# EAGLE design TrafficLights (EAGLE 9.4.2)

## Sheet 1 of 3
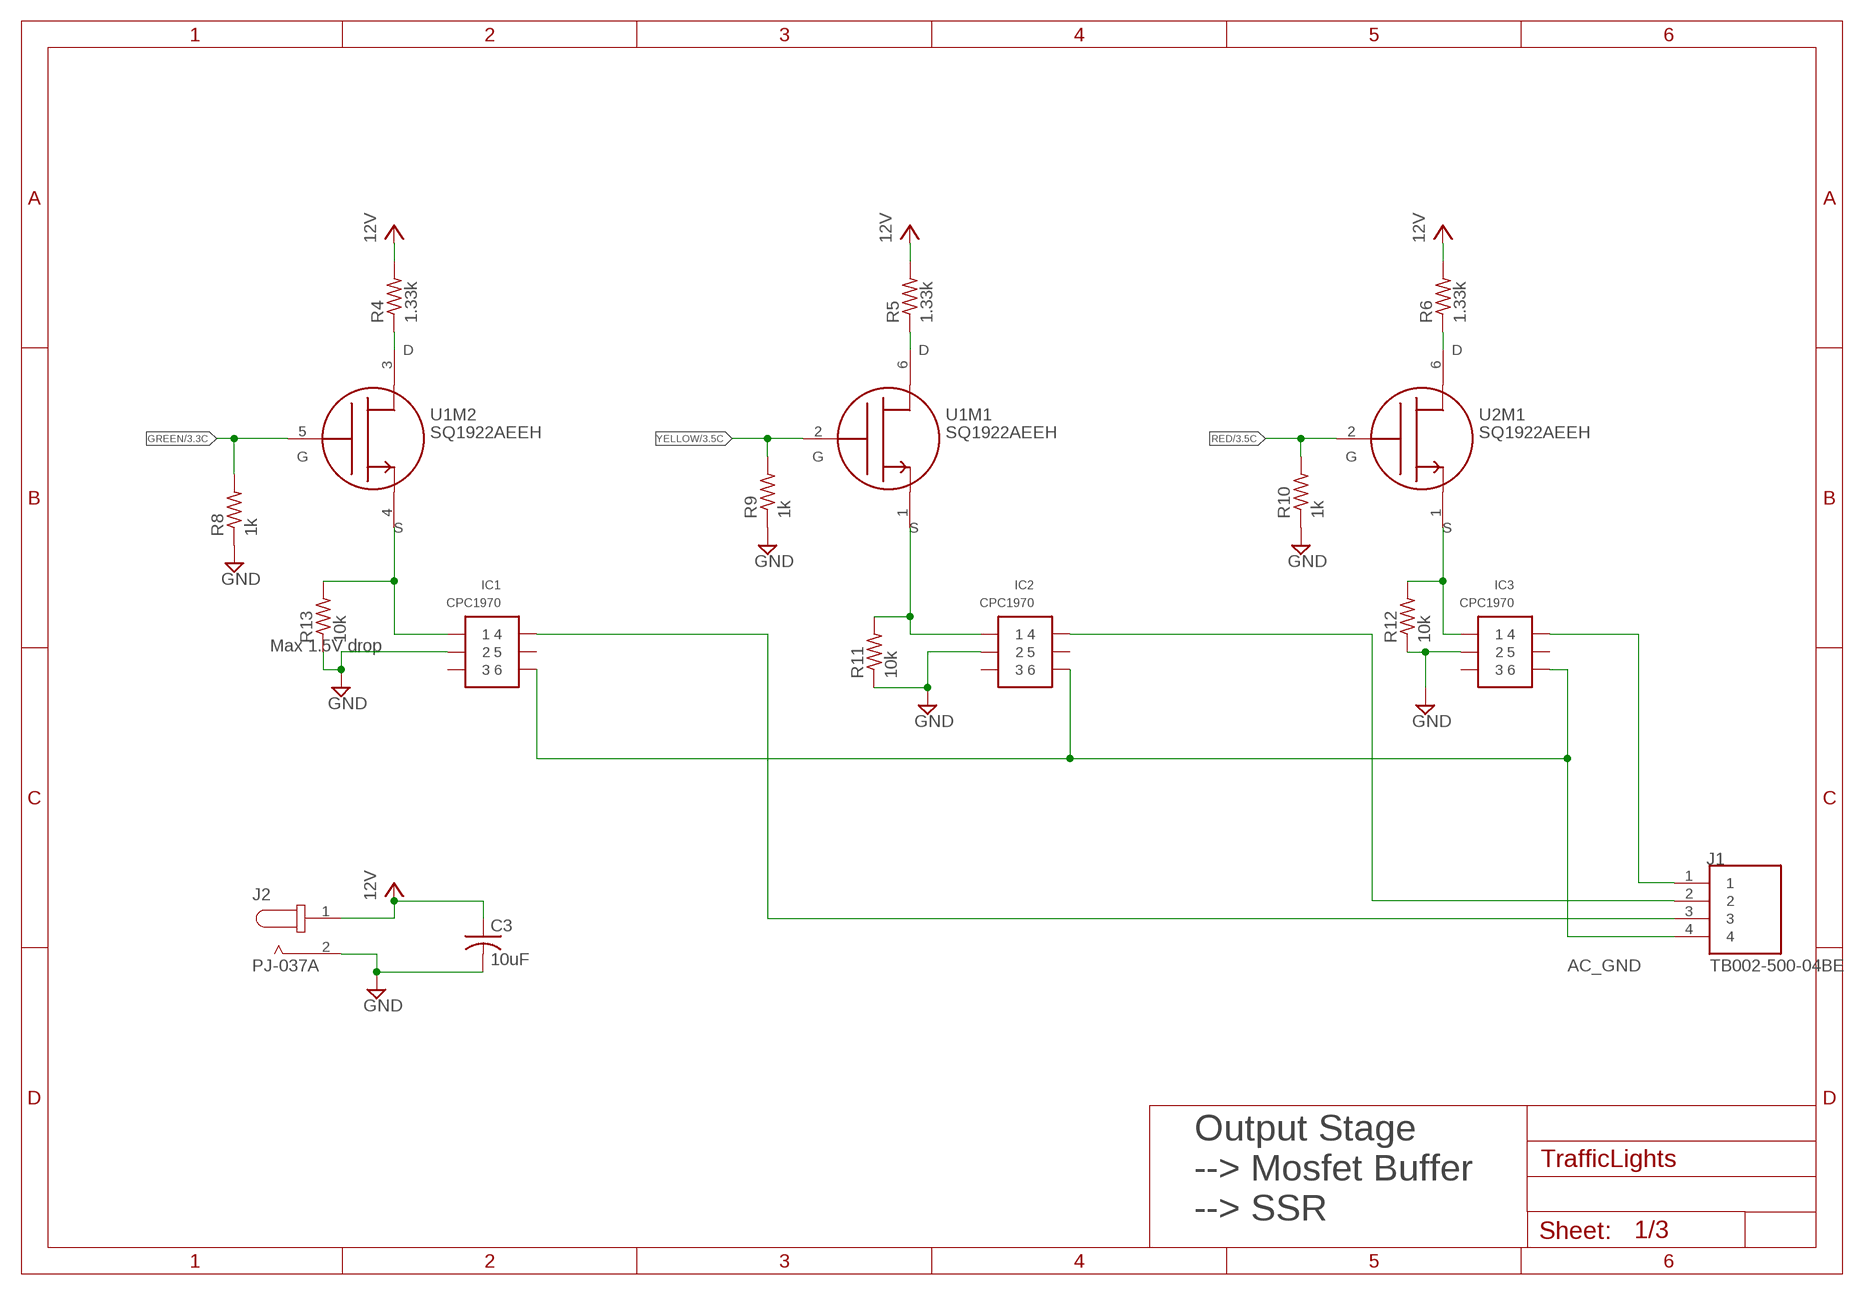
[diagram p0: schematic, sheet 1]

### Parts
C3  10uF  C-USC1206  [C1206]
IC1  CPC1970  CPC1972  [6-DIP]
IC2  CPC1970  CPC1972  [6-DIP]
IC3  CPC1970  CPC1972  [6-DIP]
J1  TB002-500-04BE  [CUI_TB002-500-04BE]
J2  PJ-037A  [CUI_PJ-037A]
R4  1.33k  R-US_R1206  [R1206]
R5  1.33k  R-US_R1206  [R1206]
R6  1.33k  R-US_R1206  [R1206]
R8  1k  R-US_R1206  [R1206]
R9  1k  R-US_R1206  [R1206]
R10  1k  R-US_R1206  [R1206]
R11  10k  R-US_0207/2V  [0207/2V]
R12  10k  R-US_0207/2V  [0207/2V]
R13  10k  R-US_R1206  [R1206]
U1  SQ1922AEEH  [SOT-363]
U2  SQ1922AEEH  [SOT-363]

### Nets
AC_GND: IC1.P$6 IC2.P$6 IC3.P$6 J1.4
GND: C3.2 IC1.P$2 IC2.P$2 IC3.P$2 J2.2 R8.1 R9.1 R10.1 R11.1 R12.1 R13.1 ; also sheet 2,3
GREEN: R8.2 U1.5(M2:G) ; also sheet 3
N$1: IC1.P$1 R13.2 U1.4(M2:S)
N$2: IC2.P$1 R11.2 U1.1(M1:S)
N$3: IC3.P$1 R12.2 U2.1(M1:S)
N$17: R4.1 U1.3(M2:D)
N$18: R5.1 U1.6(M1:D)
N$19: R6.1 U2.6(M1:D)
N$21: IC2.P$4 J1.2
N$22: IC3.P$4 J1.1
RED: R10.2 U2.2(M1:G) ; also sheet 3
VAC: IC1.P$4 J1.3
VCC: C3.1 J2.1 R4.2 R5.2 R6.2 ; supply symbol labelled 12V ; also sheet 2,3
YELLOW: R9.2 U1.2(M1:G) ; also sheet 3
Unconnected: IC1.P$3 IC1.P$5 IC2.P$3 IC2.P$5 IC3.P$3 IC3.P$5 U2.3(M2:D) U2.4(M2:S) U2.5(M2:G)

### Notes on the sheet
- Max 1.5V drop
- Output Stage
  --> Mosfet Buffer
  --> SSR

## Sheet 2 of 3
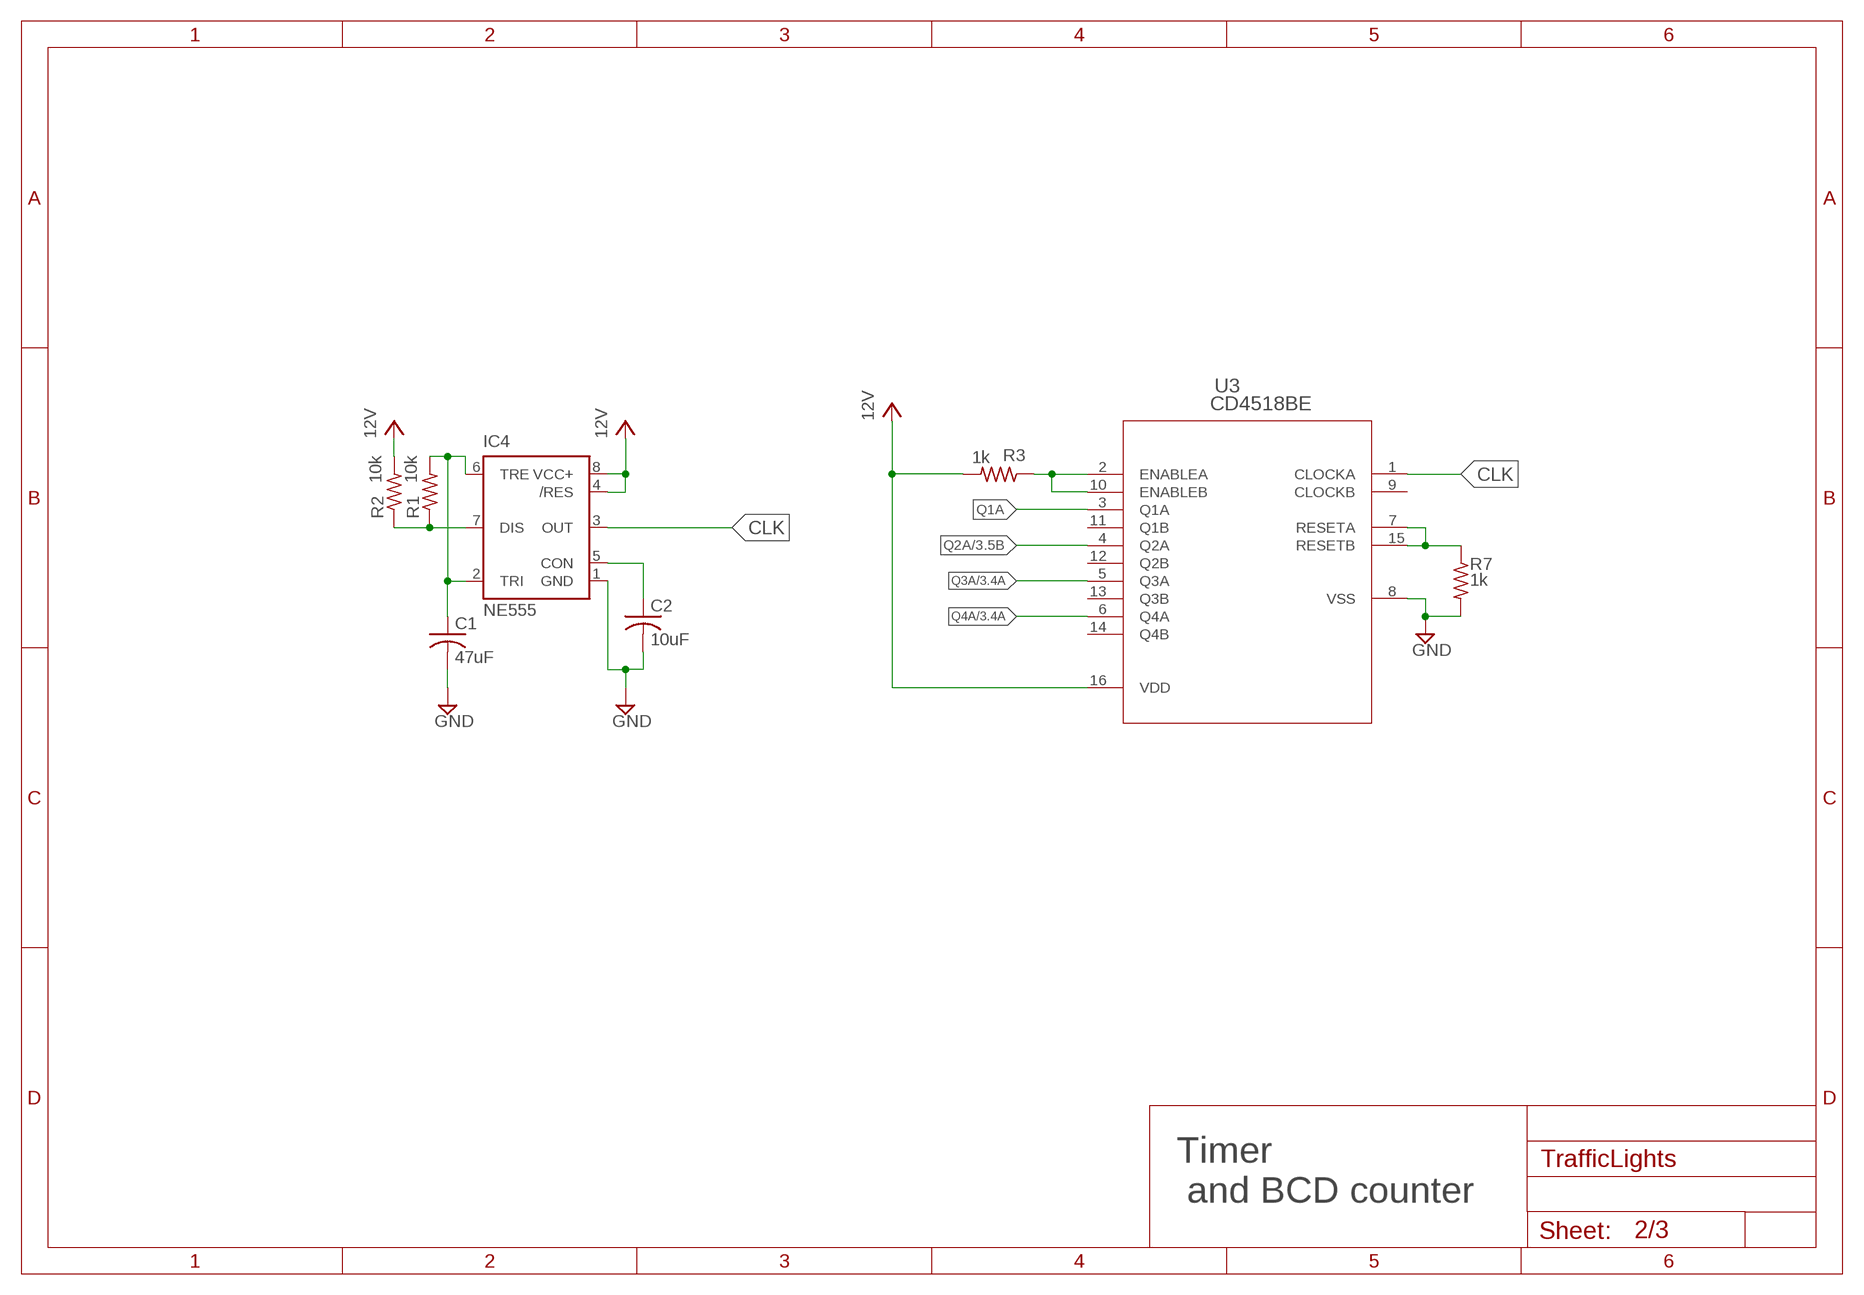
[diagram p1: schematic, sheet 2]

### Parts
C1  47uF  C-USC1206  [C1206]
C2  10uF  C-USC1206  [C1206]
IC4  NE555  [DIL-08]
R1  10k  R-US_R1206  [R1206]
R2  10k  R-US_R1206  [R1206]
R3  1k  R-US_R1206  [R1206]
R7  1k  R-US_R1206  [R1206]
U3  CD4518BE  [N16]

### Nets
CLK: IC4.3(OUT) U3.1(CLOCKA)
GND: C1.2 C2.2 IC4.1(GND) R7.2 U3.8(VSS) ; also sheet 1,3
N$4: IC4.7(DIS) R1.1 R2.1
N$5: C1.1 IC4.2(TRI) IC4.6(TRE) R1.2
N$6: C2.1 IC4.5(CON)
N$7: R3.1 U3.2(ENABLEA) U3.10(ENABLEB)
N$24: R7.1 U3.7(RESETA) U3.15(RESETB)
Q1A: U3.3(Q1A)
Q2A: U3.4(Q2A) ; also sheet 3
Q3A: U3.5(Q3A) ; also sheet 3
Q4A: U3.6(Q4A) ; also sheet 3
VCC: IC4.4(/RES) IC4.8(VCC+) R2.2 R3.2 U3.16(VDD) ; supply symbol labelled 12V ; also sheet 1,3
Unconnected: U3.9(CLOCKB) U3.11(Q1B) U3.12(Q2B) U3.13(Q3B) U3.14(Q4B)

### Notes on the sheet
- Timer
   and BCD counter

## Sheet 3 of 3
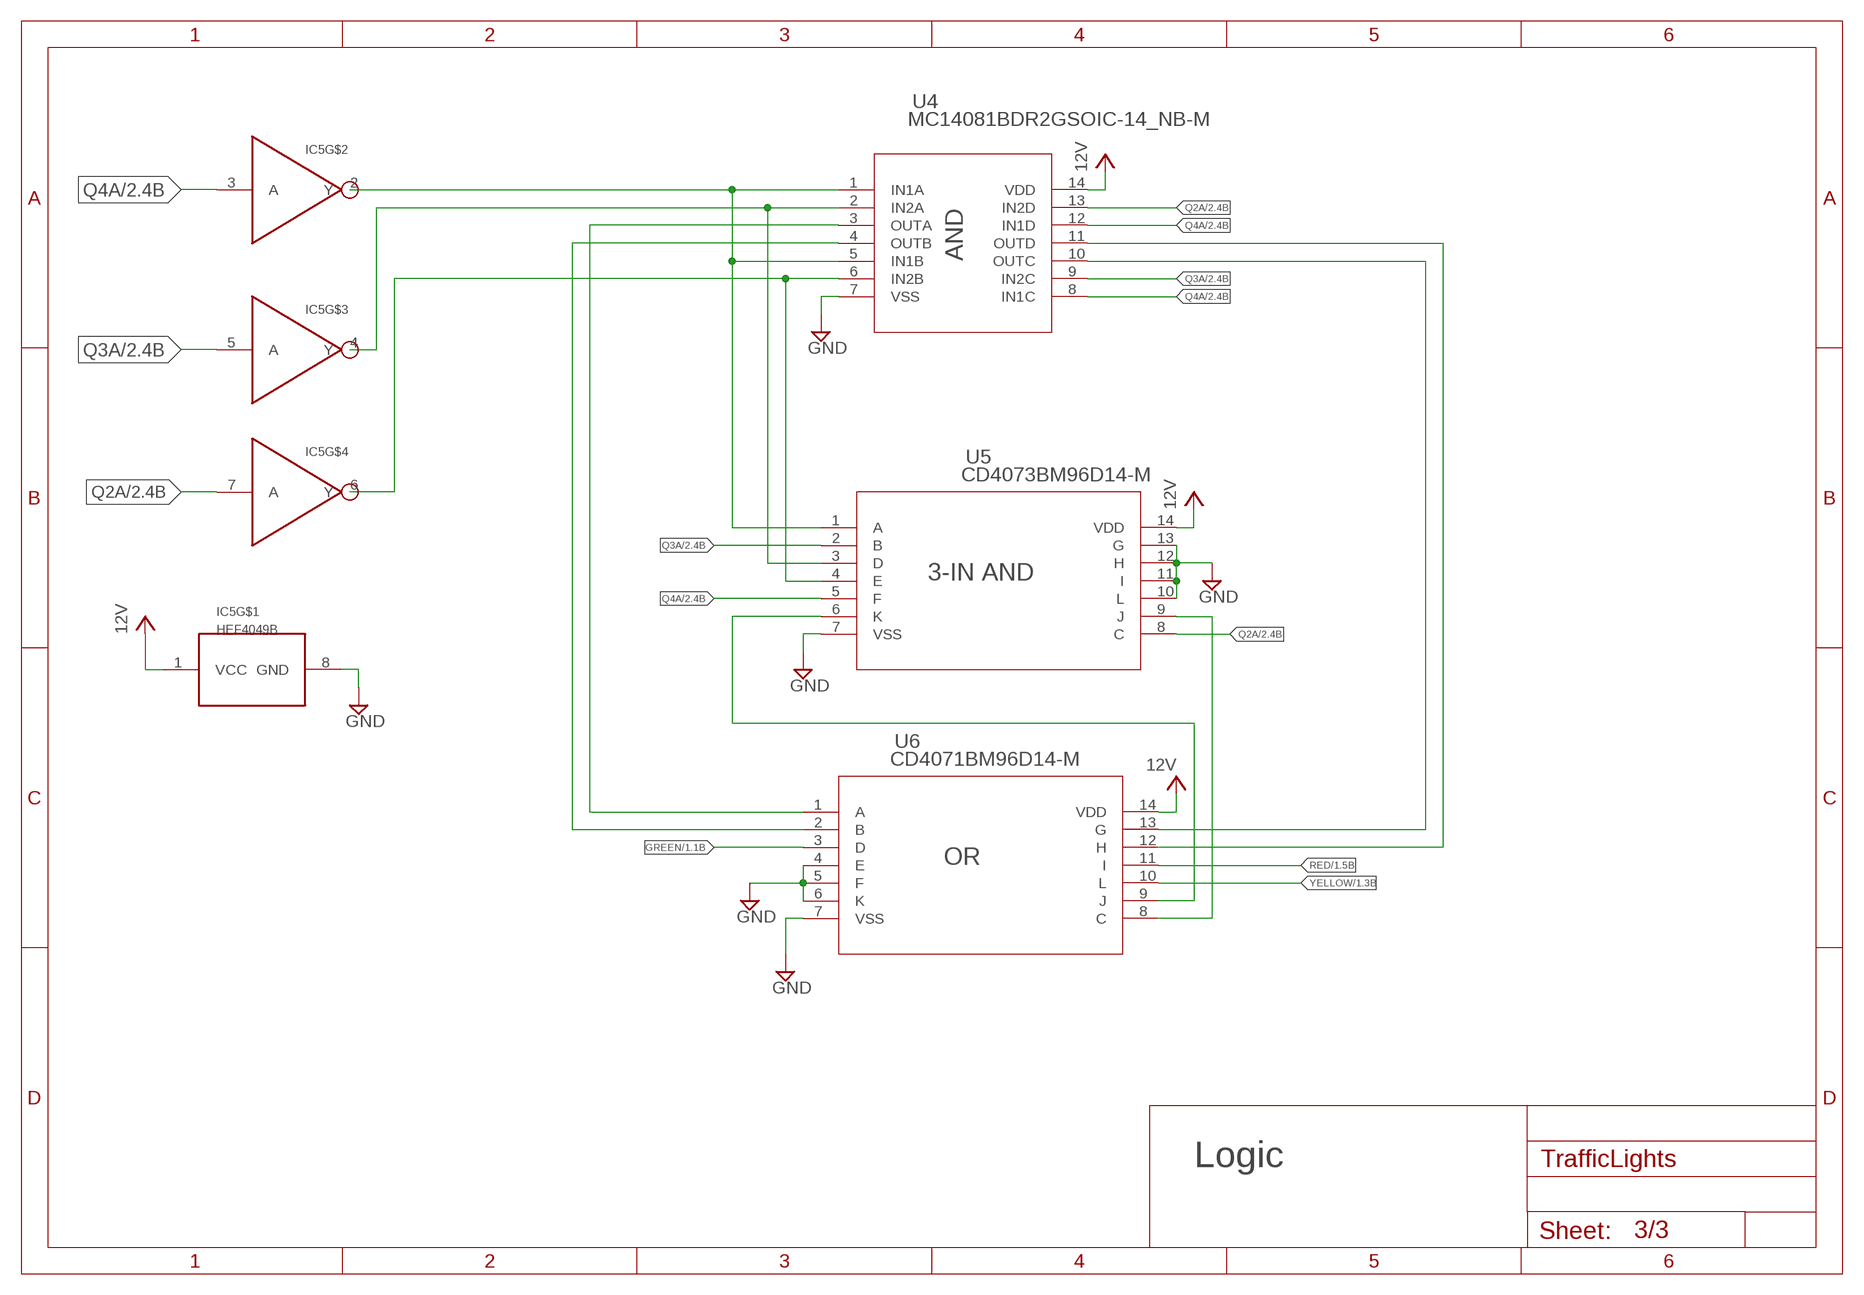
[diagram p2: schematic, sheet 3]

### Parts
IC5  HEF4049B  [SO16]
U4  MC14081BDR2GSOIC-14_NB-M  [SOIC-14_NB-M]
U5  CD4073BM96D14-M  [D14-M]
U6  CD4071BM96D14-M  CD4073BM96D14-M  [D14-M]

### Nets
GND: IC5.8(GND) U4.7(VSS) U5.7(VSS) U5.10(L) U5.11(I) U5.12(H) U5.13(G) U6.4(E) U6.5(F) U6.6(K) U6.7(VSS) ; also sheet 1,2
GREEN: U6.3(D) ; also sheet 1
N$8: IC5.2(Y) U4.1(IN1A) U4.5(IN1B) U5.1(A)
N$9: IC5.4(Y) U4.2(IN2A) U5.3(D)
N$10: IC5.6(Y) U4.6(IN2B) U5.4(E)
N$11: U4.3(OUTA) U6.1(A)
N$12: U4.4(OUTB) U6.2(B)
N$13: U4.10(OUTC) U6.13(G)
N$14: U4.11(OUTD) U6.12(H)
N$15: U5.9(J) U6.8(C)
N$16: U5.6(K) U6.9(J)
Q2A: IC5.7(A) U4.13(IN2D) U5.8(C) ; also sheet 2
Q3A: IC5.5(A) U4.9(IN2C) U5.2(B) ; also sheet 2
Q4A: IC5.3(A) U4.8(IN1C) U4.12(IN1D) U5.5(F) ; also sheet 2
RED: U6.11(I) ; also sheet 1
VCC: IC5.1(VCC) U4.14(VDD) U5.14(VDD) U6.14(VDD) ; supply symbol labelled 12V ; also sheet 1,2
YELLOW: U6.10(L) ; also sheet 1
Unconnected: IC5.9(A) IC5.10(Y) IC5.11(A) IC5.12(Y) IC5.14(A) IC5.15(Y)

### Notes on the sheet
- AND
- 3-IN AND
- OR
- Logic

## Library data of the parts
C1-C3 = rcl:C-US: CAPACITOR, American symbol; SPICEPREFIX: C
IC1-IC3 = TrafficLights:CPC1972: Solid State Relay SPST-NO (1 Form A) 6-DIP; MANUFACTURER_PART_NUMBER: CPC1972G
IC4 = st-microelectronics:NE555: General purpose bipolar Timer; MF: Arrow Electronics; MPN: NE555N; OC_FARNELL: 1467742; OC_NEWARK: 89K1486
IC5 = TrafficLights:HEF4049B
J1 = TB002-500-04BE:TB002-500-04BE; MANUFACTURER: CUI; STANDARD: Manufacturer Recommendations
J2 = PJ-037A:PJ-037A: 2.0 mm Center Pin, 2.5 A, Right Angle, Through Hole, Dc Power Jack Connector; CUI_PURCHASE_URL: https://www.cui.com/product/interconnect/connectors/dc-power-connectors/jacks/pj-037a?utm_source=snapeda.com&utm_medium=referral&utm_campaign=snapedaBOM; DESCRIPTION: 2.0 x 6.5 mm, 2.5 A, Horizontal, Through Hole, Dc Power Jack Connector; DIGI-KEY_PART_NUMBER: CP-037A-ND; DIGI-KEY_PURCHASE_URL: https://www.digikey.com/product-detail/en/cui-inc/PJ-037A/CP-037A-ND/1644545?utm_source=snapeda&utm_medium=aggregator&utm_campaign=symbol; MF: CUI Inc.; MP: PJ-037A; PACKAGE: None
R1-R13 = rcl:R-US_: RESISTOR, American symbol; SPICEPREFIX: R
U1 U2 = TrafficLights:SQ1922AEEH: Mosfet Array 2 N-Channel (Dual) 20V 850mA (Tc) 1.5W (Tc) Surface Mount SC-70-6; MANUFACTURER_PART_NUMBER: SQ1922AEEH-T1_GE3
U3 = TrafficLights:CD4518BE; MANUFACTURER_PART_NUMBER: CD4518BE; VENDOR: Texas Instruments
U4 = TrafficLights:MC14081BDR2G; MANUFACTURER_PART_NUMBER: MC14081BDR2G; VENDOR: ON Semiconductor
U5 U6 = TrafficLights:CD4073BM96; MANUFACTURER_PART_NUMBER: CD4073BM96; VENDOR: Texas Instruments

## Board
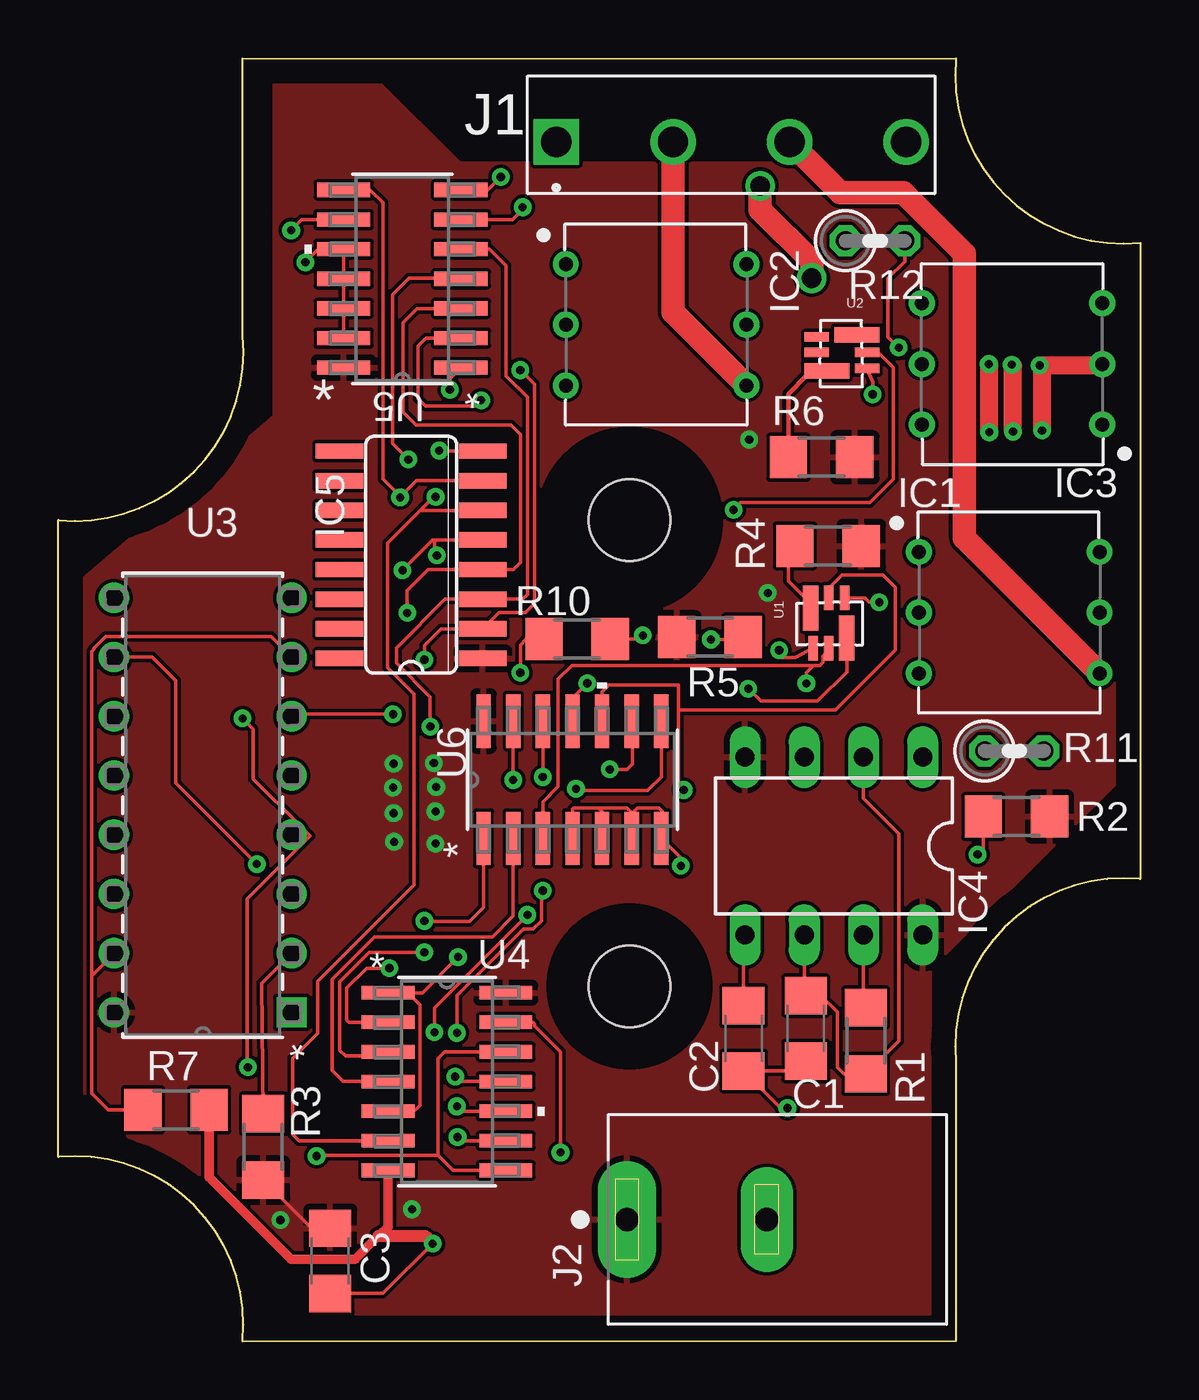
[diagram p3: board, top side]
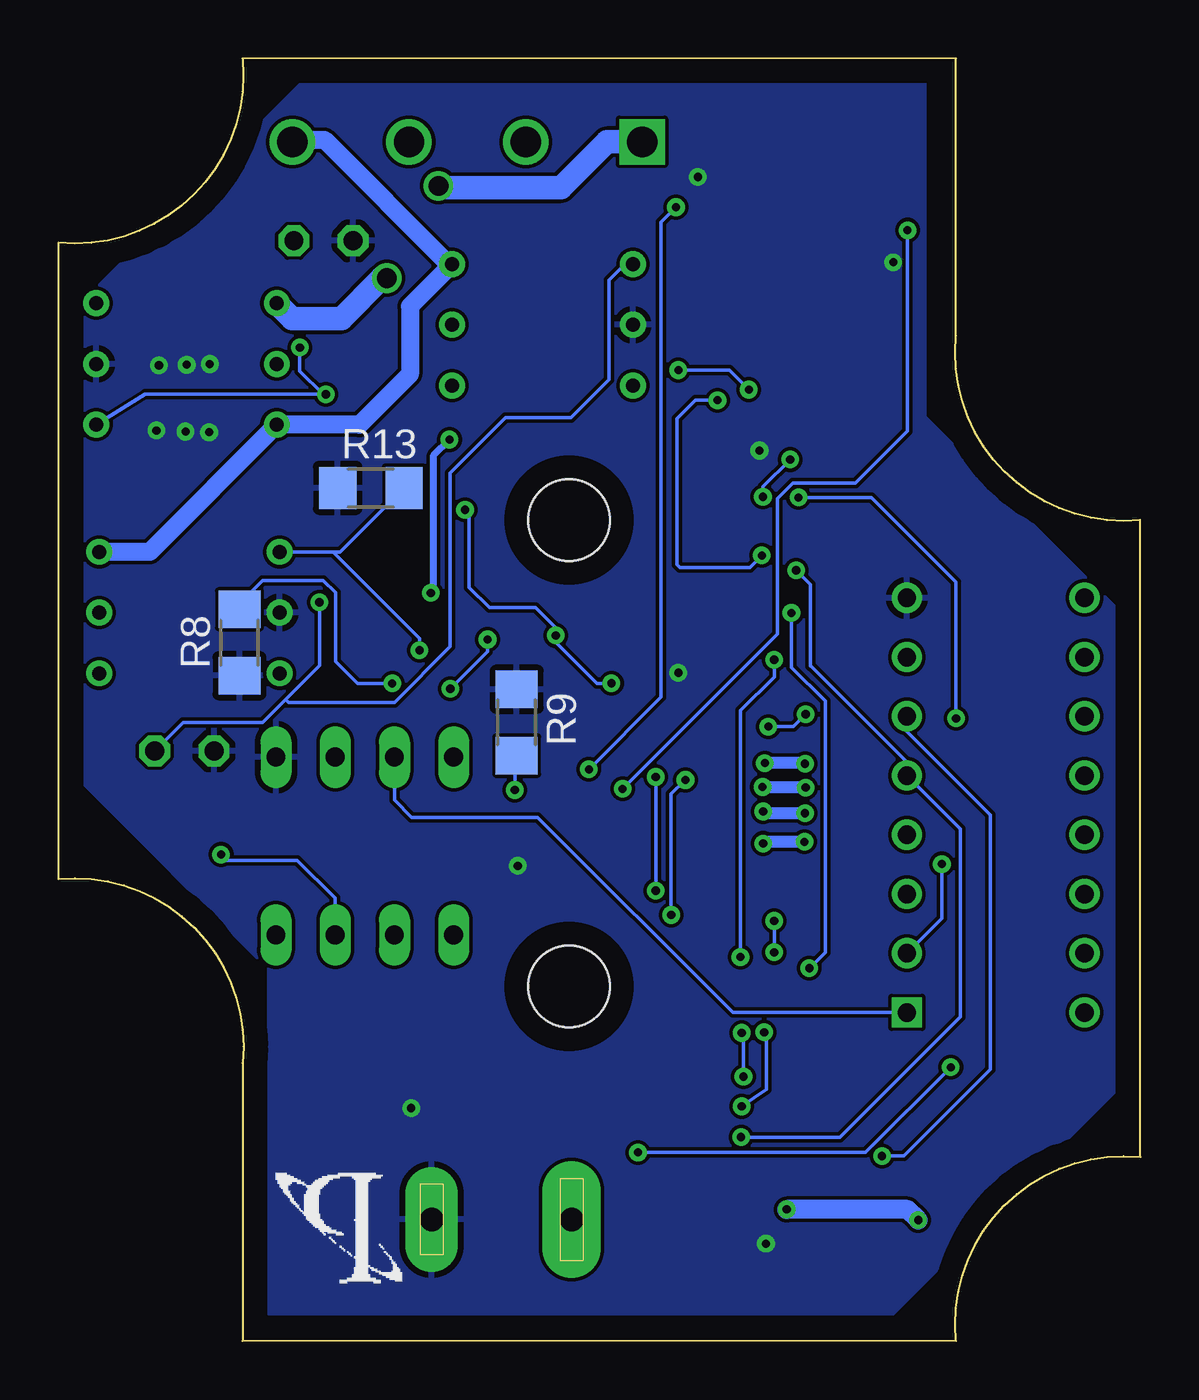
[diagram p4: board, bottom side, seen from below]

Size 46.4 x 55.02 mm. Coordinates in mm from the lower left corner, seen from the top.
Outline: 7.9,0 38.5,0.02 38.5,11.92 arc-102 46.4,19.82 46.4,47.11 arc-102 38.5,55.01 7.9,55.02 7.9,43.12 arc-102 0,35.22 0,7.9 arc-102 7.9,0
Copper layers (1*16): Top 0.035mm / dielectric 1.5mm / Bottom 0.035mm
Design rules "default": minimum track width 6mil, minimum drill 0.35mm, track to track 6mil, track to pad 6mil, pad to pad 6mil, via to via 6mil, smd to smd 6mil, copper to edge 40mil, drill to drill 6mil, minimum pad ring 10mil, minimum via ring 8mil, stop-mask expansion 4mil, vias tented up to drill 0mil, thermal gap 10mil
Holes 3.5 mm at 24.5,35.22 24.5,15.22
tKeepout: area 20.5,31.2 to 28.5,39.2; area 20.9,11.7 to 28.1,18.8
tRestrict: area 20.9,11.7 to 28.1,18.8; area 20.5,31.2 to 28.5,39.2

### Footprints (pad centres in the part's own frame; a part is rotated, then mirrored left to right if it is on the bottom)
C1206 = smd 1.6 x 1.8: 1 -1.4,0; 2 1.4,0
6-DIP = drill 0.6: P$1 -2.604,-3.874; P$2 0,-3.874; P$3 2.604,-3.874; P$4 2.604,3.874; P$5 0,3.874; P$6 -2.604,3.874
DIL-08 = drill 0.813 long: 1 -3.81,-3.81; 2 -1.27,-3.81; 3 1.27,-3.81; 4 3.81,-3.81; 5 3.81,3.81; 6 1.27,3.81; 7 -1.27,3.81; 8 -3.81,3.81
SO16 = smd 0.66 x 2.032: 1 -4.445,-3.073; 2 -3.175,-3.073; 3 -1.905,-3.073; 4 -0.635,-3.073; 5 0.635,-3.073; 6 1.905,-3.073; 7 3.175,-3.073; 8 4.445,-3.073; 9 4.445,3.073; 10 3.175,3.073; 11 1.905,3.073; 12 0.635,3.073; 13 -0.635,3.073; 14 -1.905,3.073; 15 -3.175,3.073; 16 -4.445,3.073
CUI_TB002-500-04BE = drill 1.3 square: 1 0,0 | drill 1.3: 2 5,0; 3 10,0; 4 15,0
CUI_PJ-037A = drill 1 pad 2.5 long: 1 0,0 | drill 1 pad 2.25 long: 2 6,0
R1206 = smd 1.6 x 1.803: 1 -1.422,0; 2 1.422,0
0207/2V = drill 0.813 octagon: 1 -1.27,0; 2 1.27,0
SOT-363 = smd 0.406 x 1.041: 1 -0.686,-1.079; 2 0,-1.079; 4 0.66,1.079; 5 0,1.079 | smd 0.66 x 1.93: 3 0.762,-0.648; 6 -0.787,0.648
N16 = drill 0.787 pad 1.295 square: 1 -7.62,17.78 | drill 0.787 pad 1.295: 2 -7.62,15.24; 3 -7.62,12.7; 4 -7.62,10.16; 5 -7.62,7.62; 6 -7.62,5.08; 7 -7.62,2.54; 8 -7.62,0; 9 0,0; 10 0,2.54; 11 0,5.08; 12 0,7.62; 13 0,10.16; 14 0,12.7; 15 0,15.24; 16 0,17.78
SOIC-14_NB-M = smd 2.261 x 0.584: 1 -2.527,3.81; 2 -2.527,2.54; 3 -2.527,1.27; 4 -2.527,0; 5 -2.527,-1.27; 6 -2.527,-2.54; 7 -2.527,-3.81; 8 2.527,-3.81; 9 2.527,-2.54; 10 2.527,-1.27; 11 2.527,0; 12 2.527,1.27; 13 2.527,2.54; 14 2.527,3.81
D14-M = smd 2.286 x 0.61: 1 -2.515,3.81; 2 -2.515,2.54; 3 -2.515,1.27; 4 -2.515,0; 5 -2.515,-1.27; 6 -2.515,-2.54; 7 -2.515,-3.81; 8 2.515,-3.81; 9 2.515,-2.54; 10 2.515,-1.27; 11 2.515,0; 12 2.515,1.27; 13 2.515,2.54; 14 2.515,3.81

### Placement (x,y rotation side)
C1  32.06,13.42 270 top
C2  29.39,12.99 270 top
C3  11.66,3.44 270 top
IC1  40.78,31.25 270 top
IC2  25.64,43.59 270 top
IC3  40.91,41.91 90 top
IC4  33.26,21.24 180 top
IC5  15.13,33.73 90 top
J1  21.36,51.43 0 top
J2  24.39,5.22 0 top
R1  34.63,12.89 270 top
R2  41.09,22.49 0 top
R3  8.79,8.33 270 top
R4  33.01,34.1 0 top
R5  27.95,30.19 180 top
R6  32.73,37.91 0 top
R7  5.05,9.92 0 top
R8  38.64,29.96 90 bottom
R9  26.75,26.53 270 bottom
R10  22.25,30.11 0 top
R11  41,25.31 0 top
R12  35.03,47.19 0 top
R13  33,36.59 0 bottom
U1  33.03,30.8 180 top
U2  33.61,42.4 90 top
U3  2.39,31.88 180 top
U4  16.67,11.13 0 top
U5  14.75,45.56 180 top
U6  22.05,24.08 90 top

### Tracks (layer width: path | path; a pad name or v marks a point on that pad's centre or on a via)
AC_GND
  Bottom 0.762: IC1.P$6 42.48,33.85 IC3.P$6 33.49,39.3 31.32,41.47 31.32,44.39 IC2.P$6 29.66,46.19 34.98,51.51 36.28,51.51 J1.4
CLK
  Bottom 0.152: IC4.3 31.99,23.22 31.24,22.47 25.85,22.47 17.48,14.1 U3.1
GND  (via drill 0.35)
  Top 0.152: IC5.8 16.31,38.17 v16.33,38.19 | v26.7,20.39 26.7,20.73 U6.7 25.91,21.61 25.91,22.72 25.76,22.88 24.84,22.88 24.61,22.65 | C1.2 31.63,11.59 C2.2 30.98,10 v31.27,10 | U5.7 18.42,49.37 v18.98,49.93 | R10.1 20.07,30.11 19.81,29.86 v19.81,28.67 | C3.2 13.92,2.04 v16.05,4.18 | U6.4 22.05,22.83 22.1,22.88 23.17,22.88 | U6.5 23.32,22.72 23.17,22.88 | 24.61,22.65 24.39,22.88 23.17,22.88 | U5.13 U5.12 U5.11 U5.10 11.15,46.83 v10.59,46.27 | 24.61,22.65 24.59,22.62 U6.6
  Top 0.406: R7.2 6.47,7.03 9.98,3.52 12.73,3.52 13.72,4.51 | U4.7 14.14,4.88 13.77,4.51
  Top 0.508: 13.72,4.51 13.77,4.51 15.72,4.51 v16.05,4.18
  Top 0.762: v42.19,39.06 42.19,41.75 v42.09,41.85 44.72,41.85 IC3.P$2 | v39.93,38.98 39.93,41.87 v39.9,41.9 | v40.95,39 40.95,41.82 v40.9,41.87
  pour Bottom: 9.25,54.02 9.25,39.66 9.22,39.64 1.04,31.46 1.04,29.2 1.04,10.73 10.59,1.18 37.39,1.18 37.39,15.97 37.42,15.99 45.62,24.2 45.62,44.31 35.92,54.02
GREEN  (via drill 0.35)
  Top 0.152: 32.39,28.97 22.02,28.97 21.44,28.39 21.44,23.79 20.78,23.13 U6.3 | v32.08,28.21 32.08,28.67 32.39,28.97 | U1.5 33.03,29.61 32.8,29.39 32.8,29.11 32.67,28.97 32.39,28.97
  Bottom 0.152: R8.2 38.63,31.64 37.64,32.63 35.05,32.63 34.52,32.1 34.52,29.15 33.58,28.21 v32.08,28.21
N$1  (via drill 0.35)
  Top 0.152: U1.4 31.6,29.32 30.91,29.32 v30.91,29.63
  Bottom 0.152: v30.91,29.63 30.91,30.14 34.62,33.85 | 34.62,33.85 34.75,33.85 IC1.P$1 | R13.2 34.32,33.85 34.62,33.85
N$2  (via drill 0.35)
  Top 0.152: U1.1 34.6,31.87 34.76,31.7 35.19,31.7 v35.21,31.69
  Bottom 0.152: IC2.P$1 22.1,46.19 22.79,45.51 22.79,41.24 24.42,39.61 27.21,39.61 29.59,37.23 29.59,29.78 31.98,27.4 36.53,27.4 36.65,27.52 | v35.21,31.69 35.21,28.97 36.65,27.52 | R11.2 41.05,26.53 37.64,26.53 36.65,27.52
N$3  (via drill 0.35)
  Top 0.152: U2.1 34.93,41.13 v34.93,40.6 | R12.2 36.3,46.3 35.59,45.58 35.59,43.07 v36.04,42.61
  Bottom 0.152: IC3.P$1 42.68,40.61 42.67,40.6 35.05,40.6 | v34.93,40.6 35.05,40.6 | v36.04,42.61 36.04,41.6 35.05,40.6
N$4  (via drill 0.35)
  Top 0.152: IC4.7 34.53,14.31 R1.1 | R2.1 39.67,21.12 v39.42,20.87
  Bottom 0.152: v39.42,20.87 39.18,20.63 36.16,20.63 34.53,19 IC4.7
N$5
  Top 0.152: IC4.6 31.99,14.82 C1.1 32.7,14.82 33.4,14.11 33.4,11.75 33.69,11.46 R1.2 36.04,12.88 36.04,21.76 34.52,23.28 34.52,25.03 IC4.2
N$6
  Top 0.152: IC4.5 29.39,17.36 C2.1
N$7  (via drill 0.35)
  Top 0.152: R3.1 8.72,15.34 U3.2 | v8.51,20.46 5.03,23.94 5.03,28.34 4.03,29.34 U3.10
  Bottom 0.152: U3.2 8.51,18.14 v8.51,20.46
N$8  (via drill 0.35)
  Top 0.152: U4.5 14.26,9.74 15.14,9.74 15.52,10.12 15.52,14.42 14.99,14.95 U4.1 15.62,14.95 v17.15,16.47 | v15.7,29.23 15.7,29.84 16.41,30.55 IC5.2 18.91,31.26 20.04,31.26 20.43,31.64 20.43,41.03 v19.81,41.65 | v16.79,40.81 16.79,41.27 U5.1
  Bottom 0.152: v17.15,16.47 17.15,23.59 17.15,27.04 15.7,28.49 v15.7,29.23 | v19.81,41.65 17.63,41.65 v16.79,40.81
N$9  (via drill 0.35)
  Top 0.152: U4.2 12.48,13.68 12.37,13.78 12.37,15.15 13.21,15.99 v14.2,15.99 | v14.96,31.23 14.96,32.2 15.86,33.09 IC5.4 19.51,33.09 19.81,33.39 19.81,38.88 19.41,39.28 15.34,39.28 14.78,39.84 14.78,43.68 15.39,44.29 U5.3
  Bottom 0.152: v14.2,15.99 13.51,16.68 13.51,27.44 14.96,28.9 v14.96,31.23
N$10  (via drill 0.35)
  Top 0.152: U4.6 10.32,8.6 10.04,8.87 10.04,12.13 11.11,13.2 11.11,15.42 15.27,19.57 15.27,27.75 14.12,28.9 14.12,34.23 15.53,35.63 | 15.53,35.63 IC5.6 | U5.4 17.24,45.58 15.04,45.58 14.33,44.87 14.33,38.5 v15.01,37.81 | v16.18,36.21 16.11,36.21 15.53,35.63
  Bottom 0.152: v15.01,37.81 16.18,36.64 v16.18,36.21
N$11  (via drill 0.35)
  Top 0.152: U4.3 13.96,12.23 12.32,12.23 12.07,12.48 12.07,15.41 13.34,16.68 v15.7,16.68 | U6.1 18.24,18.61 17.63,18 15.72,18 v15.7,18.02
  Bottom 0.152: v15.7,16.68 v15.7,18.02
N$12
  Top 0.152: U4.4 12.22,11.14 11.74,11.62 11.74,15.51 13.57,17.34 18.62,17.34 19.51,18.23 U6.2
N$13  (via drill 0.35)
  Top 0.152: U4.10 17.3,9.87 v17.1,10.07 | v16.13,13.25 16.13,14.29 v20.12,18.28 | v19.51,24.07 U6.13
  Bottom 0.152: v17.1,10.07 16.03,10.81 16.03,13.15 v16.13,13.25 | v20.12,18.28 20.12,23.46 v19.51,24.07
N$14  (via drill 0.35)
  Top 0.152: U4.11 17.23,11.14 v17.02,11.34 | v17.1,13.22 17.1,14.82 19.94,17.67 20.37,17.67 20.73,18.03 20.73,19.27 v20.78,19.32 | v20.78,24.2 U6.12
  Bottom 0.152: v17.02,11.34 17.02,13.15 v17.1,13.22 | v20.78,19.32 v20.78,24.2
N$15  (via drill 0.35)
  Top 0.152: U5.9 10.44,48.1 v9.98,47.64 | v22.2,23.69 22.28,23.61 25.27,23.61 25.86,24.2 U6.8
  Bottom 0.152: v9.98,47.64 9.98,39.03 12.22,36.79 14.91,36.79 15.57,36.13 15.57,30.32 v22.2,23.69
N$16  (via drill 0.35)
  Top 0.152: U5.6 19.48,48.1 19.92,48.53 v19.92,48.63 | v23.65,24.52 24.38,24.52 24.61,24.76 24.61,26.57 U6.9
  Bottom 0.152: v19.92,48.63 20.55,48 20.55,30.42 20.55,27.62 v23.65,24.52
N$17
  Top 0.152: U1.3 32.05,31.87 31.32,32.6 31.32,33.83 R4.1
N$18  (via drill 0.35)
  Top 0.152: U1.6 33.82,28.7 32.56,27.44 30.13,27.44 v29.59,27.98 | v27.99,30.09 29.27,30.09 R5.1
  Bottom 0.152: v29.59,27.98 27.99,29.58 v27.99,30.09
N$19
  Top 0.203: R6.1 31.31,40.62 32.11,41.42 U2.6
N$21
  Top 1.016: J1.2 26.36,44.14 IC2.P$4
N$22  (via drill 0.85)
  Top 1.016: v30.1,49.55 30.1,48.52 32.31,46.31 v32.31,45.58
  Bottom 1.016: J1.1 22.87,51.43 24.83,49.47 30.02,49.47 v30.1,49.55 | v32.31,45.58 32.53,45.58 34.25,43.86 36.38,43.86 IC3.P$4
N$24
  Top 0.152: R7.1 2.14,9.92 1.42,10.63 1.42,15.67 | U3.15 1.42,15.67 | 1.42,15.67 1.42,29.58 1.51,29.67 1.51,29.7 2.03,30.21 9.13,30.21 U3.7
Q2A  (via drill 0.35)
  Top 0.152: U4.13 20.35,13.68 20.43,13.6 20.43,13.53 21.54,12.41 v21.54,8.09 | v8.13,11.75 8.1,11.78 8.1,18.97 10.8,21.67 10.39,22.09 | 10.39,22.09 U3.4 | IC5.7 15.37,36.9 v14.66,36.19 14.66,36.24 13.92,36.97 13.92,48.82 13.37,49.37 U5.8 | v7.9,26.71 8.36,26.25 8.36,24.12 10.39,22.09
  Bottom 0.152: v21.54,8.09 11.79,8.09 v8.13,11.75 | v14.66,36.19 11.53,36.19 7.9,32.55 v7.9,26.71
Q3A  (via drill 0.35)
  Top 0.152: U4.9 17.28,8.6 v17.12,8.75 | v14.76,33.06 16.06,34.36 16.13,34.36 | 16.13,34.36 IC5.5 | U5.2 15.77,43.02 15.42,42.66 15.42,40.43 15.75,40.1 17.88,40.1 v18.14,40.35 | v16.23,33.7 16.13,33.8 16.13,34.36
  Bottom 0.152: v17.12,8.75 12.88,8.75 7.72,13.91 7.72,21.97 U3.5 10.01,24.83 14.12,28.95 14.15,28.95 14.15,32.45 v14.76,33.06 | v18.14,40.35 19.08,40.35 19.86,39.56 19.86,33.31 19.74,33.19 16.74,33.19 v16.23,33.7
Q4A  (via drill 0.35)
  Top 0.152: U4.8 16.92,7.33 16.28,7.97 | 16.28,7.97 16.28,12.13 16.56,12.41 U4.12 | v11.08,7.94 11.1,7.97 16.28,7.97 | U5.5 18.49,46.83 19.2,46.12 19.2,41.39 20.12,40.48 20.12,32.02 19.92,31.82 IC5.3 16.59,31.82 14.5,29.73 14.5,29.07 15.95,27.63 v15.95,26.36 | v14.35,26.89 10.1,26.89 U3.6
  Bottom 0.152: U3.6 10.01,26.15 6.43,22.57 6.43,11.66 10.15,7.94 v11.08,7.94 | v15.95,26.36 14.89,26.36 v14.35,26.89
RED  (via drill 0.35)
  Top 0.152: U6.11 22.05,27.58 v22.68,28.21 | v28.96,35.65 29.26,35.96 34.8,35.96 35.82,36.97 35.82,41.75 35.16,42.41 34.52,42.41 U2.2 | R10.2 24.92,30.11 v25.07,30.27
  Bottom 0.152: v22.68,28.21 23.29,28.21 25.07,29.99 v25.07,30.27 25.07,30.6 25.93,31.46 26.14,31.46 27.92,31.46 28.78,32.32 28.78,35.65 v28.96,35.65
VAC
  Top 1.016: J1.3 33.54,49.25 36.25,49.25 38.86,46.63 38.86,34.43 IC1.P$4
VCC  (via drill 0.35)
  Top 0.152: R3.2 10.86,4.84 C3.1
  Bottom 0.152: v30.43,32.09 30.3,32.22
  Bottom 0.305: v29.63,38.67 30.3,37.99 30.3,32.22
  Bottom 0.508: v14.38,24.77 14.4,24.79 v16.1,24.79 | v14.35,23.74 16.18,23.74 v16.2,23.77 | v14.38,22.64 16.1,22.64 v16.18,22.72 | v14.4,21.42 16.1,21.42 v16.18,21.34
  Bottom 0.813: v9.53,5.2 9.98,5.65 v15.17,5.65
  pour Top: 1.04,32.69 1.04,10.71 10.57,1.18 37.39,1.18 37.39,15.97 45.62,24.2 45.62,44.34 39.45,50.51 17.22,50.51 13.72,54.02 9.25,54.02 9.25,39.67
YELLOW  (via drill 0.35)
  Top 0.152: U6.10 23.32,27.83 23.62,28.13 26.6,28.13 26.6,27.07 | 26.6,27.07 33.33,27.07 35.89,29.63 35.89,32.32 35.36,32.86 33.61,32.86 33.03,32.28 U1.2 | 26.6,27.07 26.6,23.87 v26.82,23.64
  Bottom 0.152: v26.82,23.64 26.82,25.03 R9.2

### Text on the board
tPlace: *